# Altium schematic sheet 05_TOP_LEVEL.SchDoc
size A4; SheetNumber: 1; SheetTotal: 4
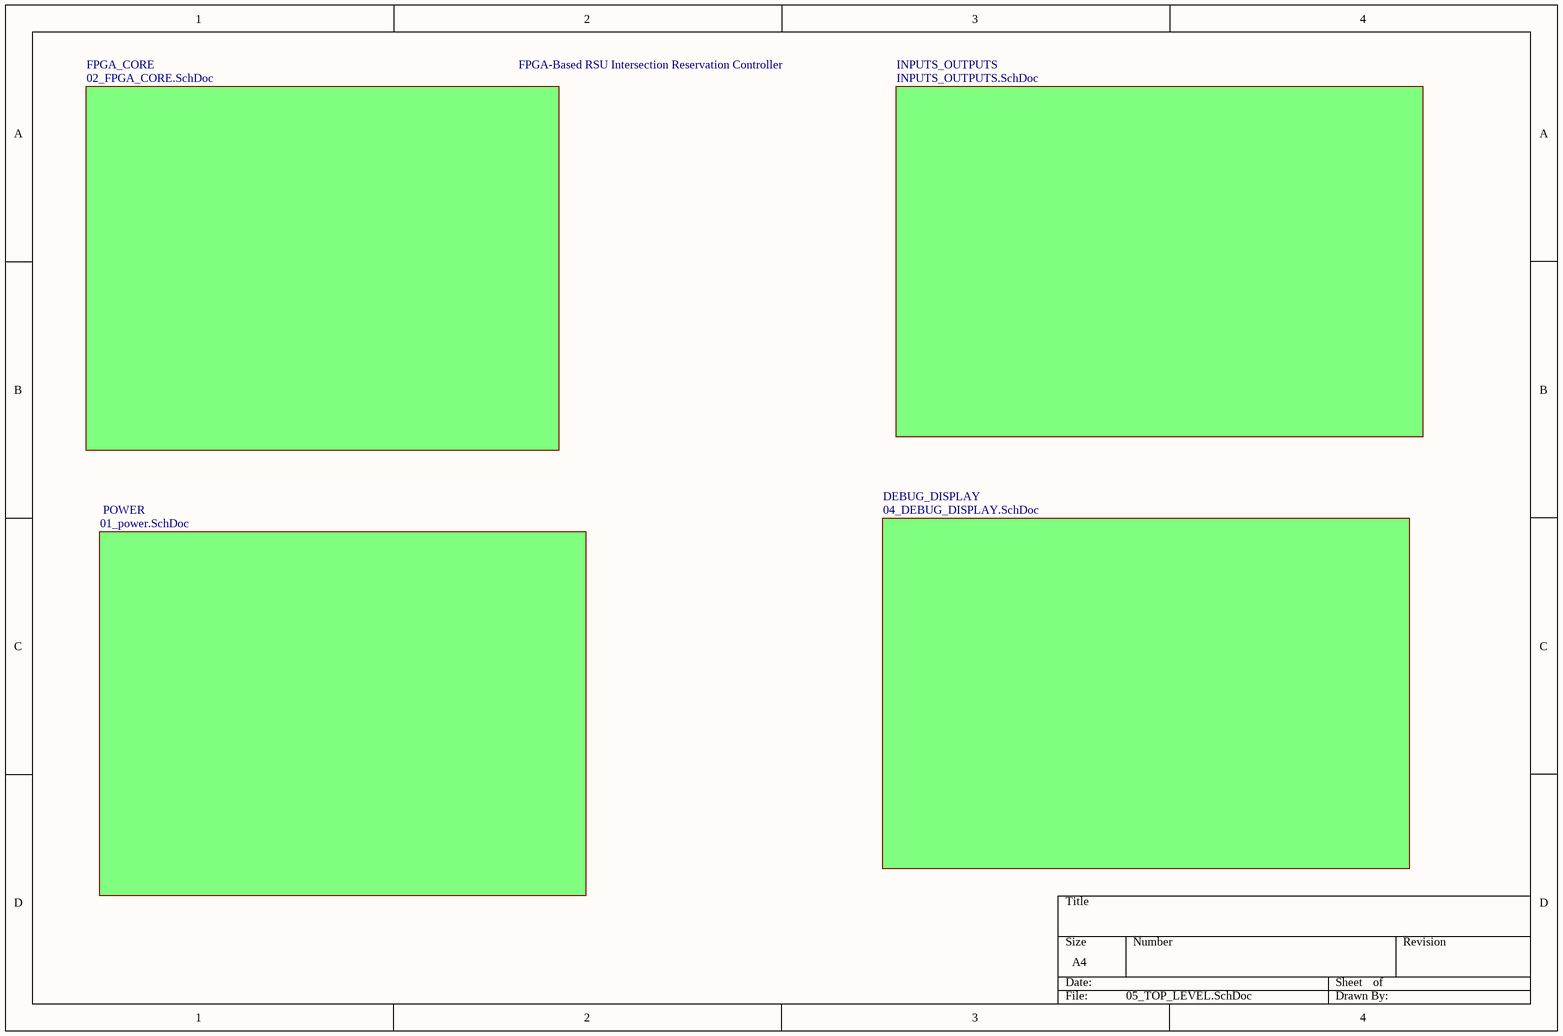
[diagram p0: 05_TOP_LEVEL.SchDoc]

## Sub-sheets
 POWER = 01_power.SchDoc: no entries
DEBUG_DISPLAY = 04_DEBUG_DISPLAY.SchDoc: no entries
FPGA_CORE = 02_FPGA_CORE.SchDoc: no entries
INPUTS_OUTPUTS = INPUTS_OUTPUTS.SchDoc: no entries

## Notes on the sheet
- FPGA-Based RSU Intersection Reservation Controller